# Altium schematic sheet Zavrsni.SchDoc
size A4
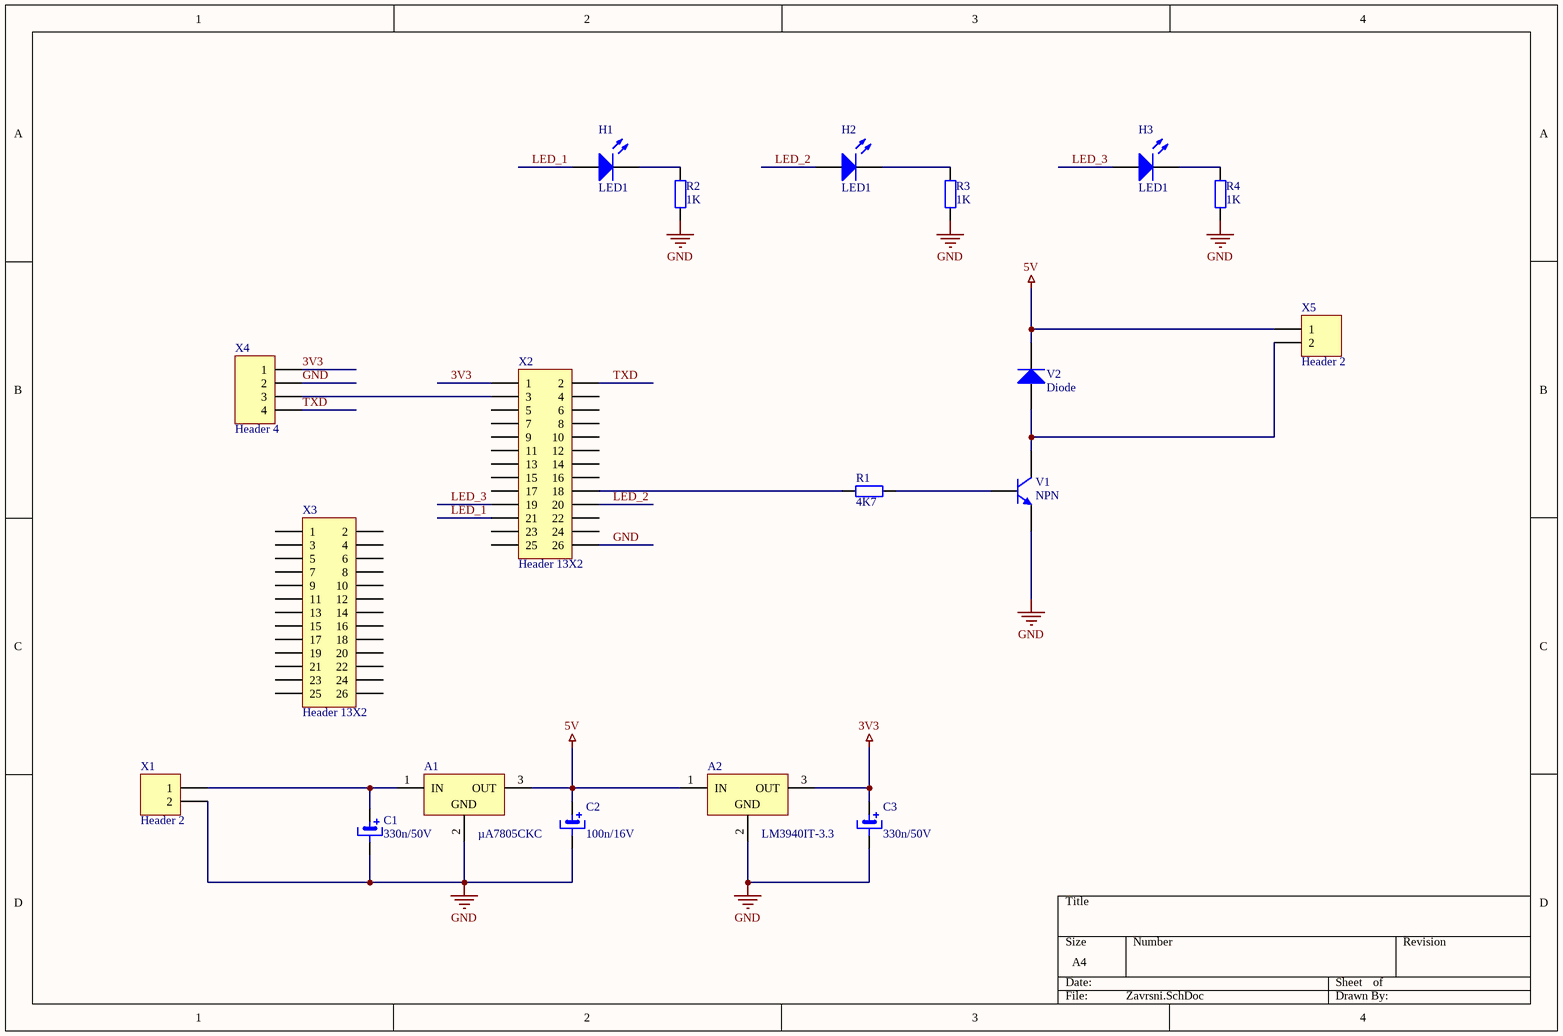
[diagram p0: Zavrsni.SchDoc]

## Parts
A1  µA7805CKC  [KC03]
A2  LM3940IT-3.3  [T03B]
C1  330n/50V  [CAPPR2-5x6.8]
C2  100n/16V  [CAPPR2-5x6.8]
C3  330n/50V  [CAPPR2-5x6.8]
H1  LED1  [LED dioda]
H2  LED1  [LED dioda]
H3  LED1  [LED dioda]
R1  4K7  [AXIAL-0.4]
R2  1K  [2012[0805]]
R3  1K  [2012[0805]]
R4  1K  [2012[0805]]
V1  NPN  [TO-226-AA]
V2  Diode  [DIODE-0.4]
X1  Header 2  [HDR1X2]
X2  Header 13X2  [HDR2X13]
X3  Header 13X2  [HDR2X13]
X4  Header 4  [HDR1X4]
X5  Header 2  [HDR1X2]

## Nets
3V3: A2.3(OUT) C3.1 X2.1 X4.1
5V: A1.3(OUT) A2.1(IN) C2.1 V2.2(K) X5.1
GND: A1.2(GND) A2.2(GND) C1.2 C2.2 C3.2 R2.1 R3.1 R4.1 V1.3(E) X1.2 X2.26 X4.2
LED_1: H1.1(A) X2.21
LED_2: H2.1(A) X2.20
LED_3: H3.1(A) X2.19
TXD: X2.2 X4.4
NetA1_1: A1.1(IN) C1.1 X1.1
NetH1_2: H1.2(K) R2.2
NetH2_2: H2.2(K) R3.2
NetH3_2: H3.2(K) R4.2
NetR1_1: R1.1 X2.18
NetR1_2: R1.2 V1.2(B)
NetV1_1: V1.1(C) V2.1(A) X5.2
NetX2_3: X2.3 X4.3

Not connected (* = marked no-connect by the designer): X2 4 5 6 7 8 9 10 11 12 13 14 15 16 17 22 23 24 25; X3 1 2 3 4 5 6 7 8 9 10 11 12 13 14 15 16 17 18 19 20 21 22 23 24 25 26

## Library data of the parts
A1 = µA7805CKC: Positive-Voltage Regulator; Note: Pin 2 is electrically connected to TAB.; Published: 15-Apr-2002; DatasheetVersion: Jul-1999; PackageVersion: Sep-1995; PackageReference: KC03; Publisher: Altium Limited; PackageDescription: TO, Thru-Hole, Vertical, Heatsink Mounted; 3 In-Line Leads; Pitch 2.54 mm; ComponentLink1Description: Manufacturer Link; ComponentLink1URL: http://www.ti.com/; ComponentLink2Description: Datasheet; ComponentLink2URL: http://www-s.ti.com/sc/ds/ua7805.pdf
A2 = LM3940IT-3.3: 1A Low Dropout Regulator for 5V to 3.3V Conversion, 3-pin TO-220; Manufacturer: National Semiconductor; PackageTopMarking: NSUZXYTTE#*LM3940IT*-3.3 P+; PowerWise: N; CompType: LDO IC; Published: 4-Dec-2008; DatasheetVersion: Jul-2007; PackageVersion: revL, Jan-1992; PackageReference: T03B; Publisher: Altium Limited; PackageDescription: TO-220, Molded, 3 Lead, Straight; Supplier 1: Farnell; Supplier Part Number 1: 9494553; PartNumber: LM3940IT-3.3; RoHS: N; PinCount: 3; ComponentLink1Description: LM3940 Datasheet; ComponentLink1URL: http://www.national.com/ds/LM/LM3940.pdf; ComponentLink2Description: LM3940 Web Page; ComponentLink2URL: http://www.national.com/pf/LM/LM3940.html; ComponentLink3Description: T03B Package Page; ComponentLink3URL: http://www.national.com/packaging/folders/t03b.html
C1-C3 = Elko: Electrolytic capacitor
  C1 C3: Value: 330n/50V
  C2: Value: 100n/16V
H1-H3 = LED1: Typical RED GaAs LED; Published: 8-Jun-2000; LatestRevisionDate: 08-Jul-2005; LatestRevisionNote: Mech Layer 1 removed.; PackageReference: LED-1; Publisher: Altium Limited; PackageDescription: LED; 2 Leads
R1-R4 = Res2: Resistor; Published: 8-Jun-2000; LatestRevisionDate: 17-Jul-2002; LatestRevisionNote: Re-released for DXP Platform.; PackageReference: AXIAL-0.4; Publisher: Altium Limited; PackageDescription: Axial Device, Thru-Hole; 2 Leads; 0.4 in Pin Spacing
  R1: Value: 4K7
  R2-R4: Value: 1K; Price: 0.93 kn; StockNo: 1576459; Supplier: Farnell
V1 = NPN: NPN Bipolar Transistor; Published: 8-Jun-2000; LatestRevisionDate: 17-Jul-2002; LatestRevisionNote: Re-released for DXP Platform.; PackageReference: TO-226-AA; Publisher: Altium Limited; PackageDescription: TO, Flat Index; 3 In-Line, Axial Leads; Body Dia. 4.8mm; Leads 0.55 x 0.51 mm (max); Code_JEDEC: TO-226-AA
V2 = Diode: Default Diode; Published: 8-Jun-2000; LatestRevisionDate: 17-Jul-2002; LatestRevisionNote: Re-released for DXP Platform.; PackageVersion: Sep-1996; PackageReference: SMC; Publisher: Altium Limited; PackageDescription: DO-214-AB/SMC; 2 C-Bend Leads; Body 7.9 x 5.9 mm, inc. leads (LxW); Code_JEDEC: DO-214-AB
X1 X5 = Header 2: Header, 2-Pin; LatestRevisionDate: 17-Jul-2002; LatestRevisionNote: Re-released for DXP Platform.; Publisher: Altium Limited
X2 X3 = Header 13X2: Header, 13-Pin, Dual row; LatestRevisionDate: 17-Jul-2002; LatestRevisionNote: Re-released for DXP Platform.; Publisher: Altium Limited
X4 = Header 4: Header, 4-Pin; LatestRevisionDate: 17-Jul-2002; LatestRevisionNote: Re-released for DXP Platform.; Publisher: Altium Limited